# Altium schematic sheet PMP20634_Sheet1.SchDoc
size 431 x 279 mm; Date: Not shown in title block; ApprovedBy: Not shown in title block; CheckedBy: Not shown in title block; Author: Not shown in title block; CompanyName: Not shown in title block; Engineer: Not shown in title block; Organization: Not shown in title block; Address1: Not shown in title block; Address2: Not shown in title block; Address3: Not shown in title block; Address4: Not shown in title block; DocumentNumber: 1; Revision: Use project parameter SCH_Rev; SheetNumber: 1; SheetTotal: 1; PageSetup: Record=PageOptions|CenterHorizontal=True|CenterVertical=True|PrintScale=1.00|XCorrection=1.00|YCorrection=1.00|PrintKind=0|BorderSize=5000000|LeftOffset=0|BottomOffset=0|Orientation=2|PaperLength=1000|PaperWidth=1000|Scale=100|PaperSource=15|PrintQuality=600|MediaType=1|DitherType=10|PaperKind=Letter|PrintScaleMode=1; CurrentTime: Not shown in title block; CurrentDate: Not shown in title block; Time: Not shown in title block; DocumentFullPathAndName: Not shown in title block; DocumentName: Not shown in title block; ModifiedDate: Not shown in title block; ImagePath: Not shown in title block
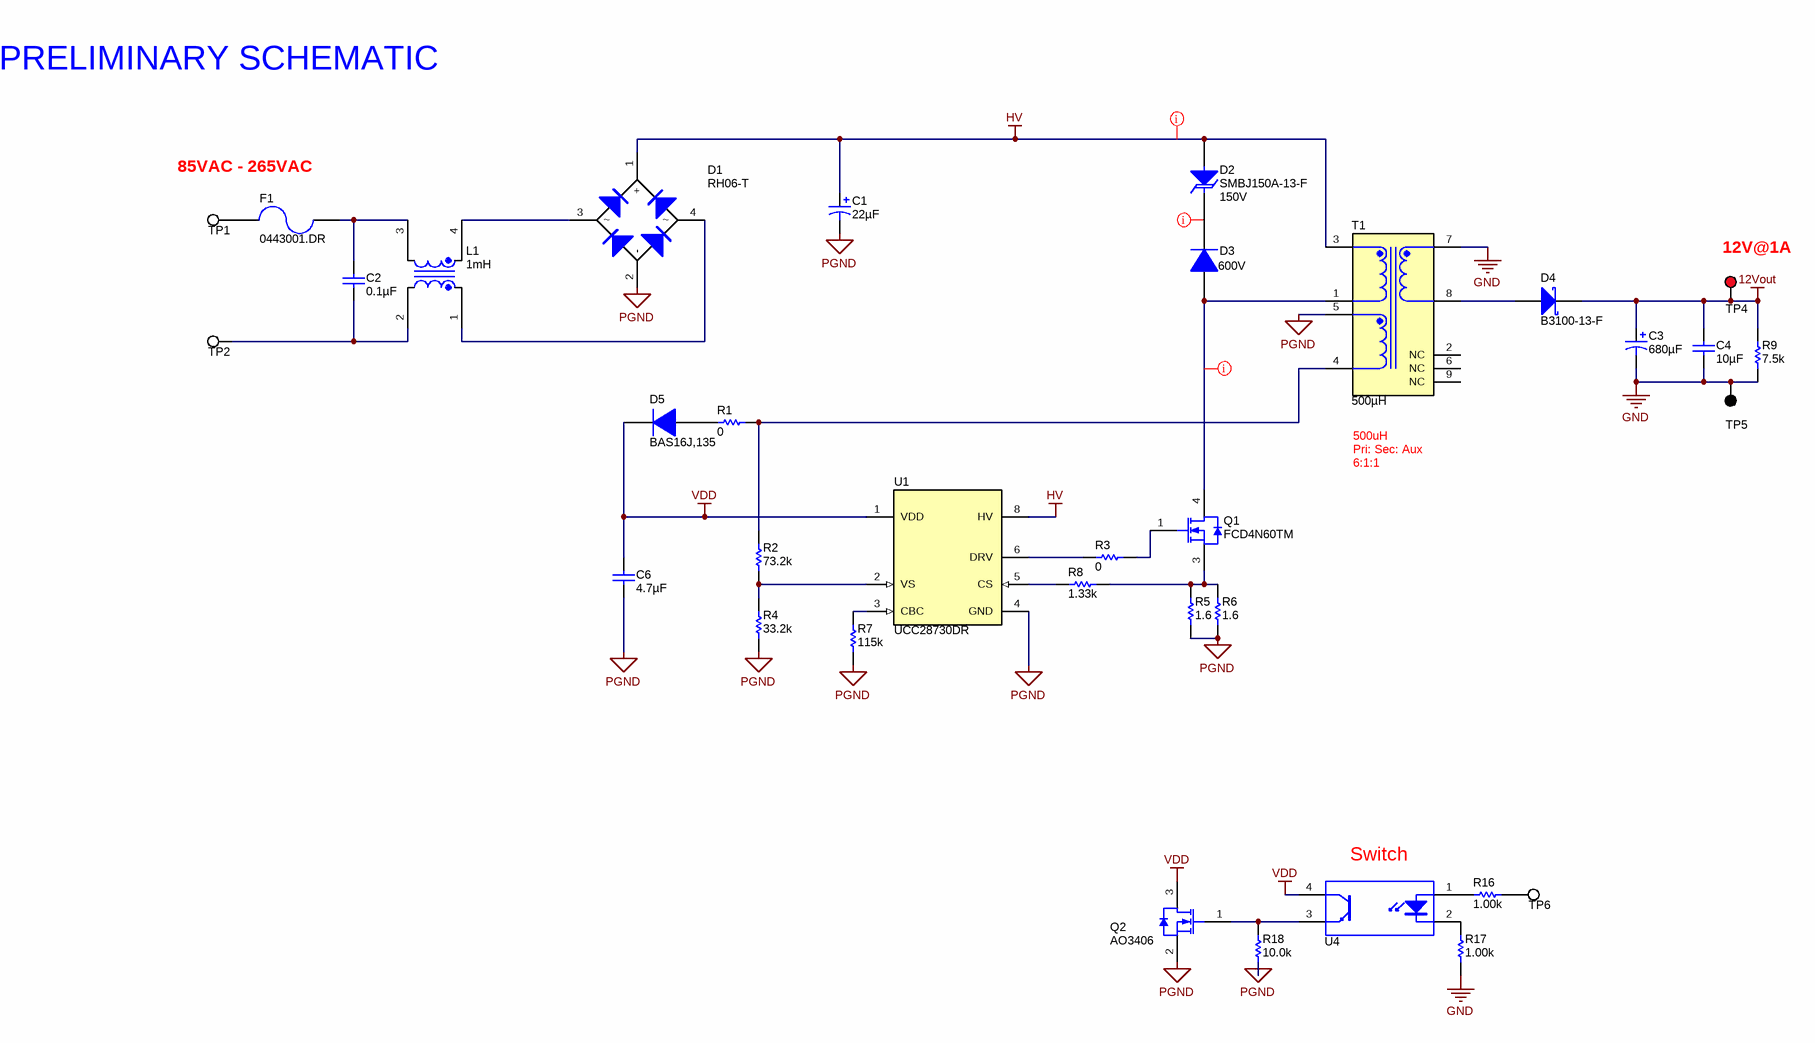
[diagram p0: PMP20634_Sheet1.SchDoc]

## Parts
C1  ValueDisplayed: 22µF  [KXG_1250x2000]  (hidden comment: EKXG401ELL220MK20S)
C2  ValueDisplayed: 0.1µF  [ECQUG_1500x800x1500]  (hidden comment: ECQ-U3A104MG)
C3  ValueDisplayed: 680µF  [Chemi-Con_1000x2000]  (hidden comment: EKZE250ELL681MJ20S)
C4  ValueDisplayed: 10µF  [0805_HV]  (hidden comment: GRM219R61E106KA12)
C6  ValueDisplayed: 4.7µF  [0603]  (hidden comment: GRM188R6YA475KE15D)
D1  RH06-T  [MiniDIP]
D2  SMBJ150A-13-F  value 150V  [SMB]
D3  Value2: 600V  [SMA]  (hidden comment: MURA160T3G)
D4  B3100-13-F  [SMC]
D5  BAS16J,135  [SOD-323F]
F1  0443001.DR  [FUSE_0443]
L1  ValueDisplayed: 1mH  [WE-CMB_XS]  (hidden comment: 744821201)
Q1  FCD4N60TM  [DPAK]
Q2  AO3406  [SOT-23]
R1  ValueDisplayed: 0  [0402]  (hidden comment: CRCW04020000Z0ED)
R2  ValueDisplayed: 73.2k  [0402]  (hidden comment: CRCW040273K2FKED)
R3  ValueDisplayed: 0  [0402]  (hidden comment: CRCW04020000Z0ED)
R4  ValueDisplayed: 33.2k  [0402]  (hidden comment: CRCW040233K2FKED)
R5  ValueDisplayed: 1.6  [0805_HV]  (hidden comment: CRCW08051R60JNEA)
R6  ValueDisplayed: 1.6  [0805_HV]  (hidden comment: CRCW08051R60JNEA)
R7  ValueDisplayed: 115k  [0402]  (hidden comment: CRCW0402115KFKED)
R8  ValueDisplayed: 1.33k  [0402]  (hidden comment: CRCW04021K33FKED)
R9  ValueDisplayed: 7.5k  [0402]  (hidden comment: CRCW04027K50JNED)
R16  ValueDisplayed: 1.00k  [0402]  (hidden comment: CRCW04021K00FKED)
R17  ValueDisplayed: 1.00k  [0402]  (hidden comment: CRCW04021K00FKED)
R18  ValueDisplayed: 10.0k  [0402]  (hidden comment: CRCW040210K0FKED)
T1  ValueDisplayed: 500µH  [Wurth_EE16-8-5_5280]  (hidden comment: 750316686)
TP1  5012  [Keystone5012]  (value not drawn)
TP2  5012  [Keystone5012]  (value not drawn)
TP4  5010  [Keystone5010]  (value not drawn)
TP5  5011  [Keystone5011]  (value not drawn)
TP6  5002  [Keystone5002]  (value not drawn)
U1  UCC28730DR  [D0007A_N]
U4  VOS617A-7X001T  [SSOP-4_VISHAY]  (value not drawn)

## Nets
12Vout: C3.1(+) C4.1 D4.1(K) R9.2 TP4.1
GND: C3.2(-) C4.2 R9.1 R17.2 T1.7 TP5.1
HV: C1.1(+) D1.1(+) D2.2(A) T1.3 U1.8(HV)
PGND: C1.2(-) C6.2 D1.2(-) Q2.2(S) R4.1 R5.1 R6.1 R7.1 R18.1 T1.5 U1.4(GND)
VDD: C6.1 D5.1(K) Q2.3(D) U1.1(VDD) U4.4(C)
NetC2_1: C2.1 F1.1 L1.3
NetC2_2: C2.2 L1.2 TP2.1
NetD1_3: D1.3 L1.4
NetD1_4: D1.4 L1.1
NetD2_1: D2.1(K) D3.1(K)
NetD3_2: D3.2(A) Q1.4(D) T1.1
NetD4_2: D4.2(A) T1.8
NetD5_2: D5.2(A) R1.1
NetF1_2: F1.2 TP1.1
NetQ1_1: Q1.1(G) R3.2
NetQ1_3: Q1.3(S) R5.2 R6.2 R8.2
NetQ2_1: Q2.1(G) R18.2 U4.3(E)
NetR1_2: R1.2 R2.2 T1.4
NetR2_1: R2.1 R4.2 U1.2(VS)
NetR3_1: R3.1 U1.6(DRV)
NetR7_2: R7.2 U1.3(CBC)
NetR8_1: R8.1 U1.5(CS)
NetR16_1: R16.1 TP6.1
NetR16_2: R16.2 U4.1(A)
NetR17_1: R17.1 U4.2(K)

Not connected (* = marked no-connect by the designer): T1 2(NC) 6(NC) 9(NC)

## Layout directives
rule Undefined: HV, NetD2_1, NetD3_2

## Notes on the sheet
- PRELIMINARY SCHEMATIC
- 85VAC - 265VAC
- (near TP4) 12V@1A
- (near T1) 500uH
- Pri: Sec: Aux
- 6:1:1
- (near U4) Switch
- Drawn By:
- SVN Rev:
- Number:
- TID #:
- Orderable:
- Rev:
- Sheet Title:
- File:
- Project Title:
- Designed for:
- Assembly Variant:
- Mod. Date:
- Sheet:
- Size:
- of
- B
- http://www.ti.com
- Texas Instruments and/or its licensors do not warrant the accuracy or completeness of this specification or any information contained therein. Texas Instruments and/or its licensors do not warrant that this design will meet the specifications, will be suitable for your application or fit for any particular purpose, or will operate in an implementation. Texas Instruments and/or its licensors do not warrant that the design is production worthy. You should completely validate and test your design implementation to confirm the system functionality for your application.
- Engineer:
- Contact:
- © Texas Instruments

## Library data of the parts
C1 = EKXG401ELL220MK20S: CAP, AL, 22 µF, 400 V, +/- 20%, TH; Manufacturer: Chemi-Con; Polarized: Y; CompType: Capacitor; Value: 22uF; U/M: EA; Cap_F: 0.000022; Tolerance_%: 20; Value1: Unknown; VDC_V: 400; Value2: 400V; IRMS_A: 0.26; TaMin_C: -40; TaMax_C: 105; Cap_Case: 12.5x20; SizeAreaWB_mm2: 210.25; SizeArea_mm2: 156.25; SizeX_mm: 12.5; SizeZ_mm: 21.5; AEC Category: Q200; SymbolVersion: 2008-07-09; PartNumber: EKXG401ELL220MK20S; PackageReference: 12.5x20mm; RoHS: Y; MountType: TH; Technology: AL; Series: KXG; SizeY_mm: 12.5; Publisher: Texas Instruments; LatestRevisionDate: 2016-10-27; ComponentLink1Description: Datasheet link; ComponentLink1URL: http://www.chemi-con.com/components/com_lcatalog/uploaded/3/3/2/185519594952d6c4a999b09.pdf; Supplier 1: Digi-Key; Supplier Part Number 1: 565-1463-ND; Supplier 2: Mouser; Supplier Part Number 2: 661-EKXG401ELL220MK2; Supplier 3: Farnell; Supplier Part Number 3: 2113044; AEC Qualified: ?
C2 = ECQ-U3A104MG: CAP, Film, 0.1 µF, 300 V, +/- 20%, TH; Manufacturer: Panasonic; Polarized: N; CompType: Capacitor; Value: 0.1uF; U/M: EA; Cap_F: 0.0000001; Tolerance_%: 20; Value1: Unknown; VDC_V: 300; Value2: 300V; TaMin_C: -40; TaMax_C: 100; Cap_Case: 15x8x15mm; AEC Category: Q200; SymbolVersion: 2008-07-09; PartNumber: ECQ-U3A104MG; PackageReference: TH, 2-Leads, Body 15x8mm, Pin Spacing 12.5mm; RoHS: Y; MountType: TH; Technology: Film; Series: ECQUG; Publisher: Texas Instruments; LatestRevisionDate: 2016-10-27; ComponentLink1Description: Datasheet link; ComponentLink1URL: http://industrial.panasonic.com/www-data/pdf/ABD0000/ABD0000CE30.pdf; Supplier 1: Digi-Key; Supplier Part Number 1: P11116-ND; Supplier 2: Mouser; Supplier Part Number 2: 667-ECQ-U3A104MG; Supplier 3: Farnell; Supplier Part Number 3: 1854815; AEC Qualified: ?
C3 = EKZE250ELL681MJ20S: CAP, AL, 680 µF, 25 V, +/- 20%, TH; Manufacturer: Chemi-Con; Polarized: Y; CompType: Capacitor; Value: 680uF; U/M: EA; Cap_F: 0.00068; Tolerance_%: 20; Value1: Unknown; VDC_V: 25; Value2: 25V; IRMS_A: 1.82; TaMin_C: -40; TaMax_C: 105; Cap_Case: 10x20; SizeAreaWB_mm2: 144; SizeArea_mm2: 100; SizeX_mm: 10; SizeZ_mm: 21.5; AEC Category: Q200; AEC Qualified: N; SymbolVersion: 2008-07-09; PartNumber: EKZE250ELL681MJ20S; PackageReference: D10xL20mm; RoHS: Y; MountType: TH; Technology: AL; Series: KZE; SizeY_mm: 10; Publisher: Texas Instruments; LatestRevisionDate: 2016-10-27; ComponentLink1Description: Datasheet link; ComponentLink1URL: http://www.chemi-con.co.jp/cgi-bin/CAT_DB/SEARCH/cat_db_al.cgi?e=e&j=p&pdfname=kze; Supplier 1: Digi-Key; Supplier Part Number 1: 565-1679-ND; Supplier 2: Mouser; Supplier Part Number 2: 661-EKZE250ELL681MJ2; Supplier 3: Farnell; Supplier Part Number 3: 1691149; AEC Grade: N/A
C4 = GRM219R61E106KA12: CAP, CERM, 10 µF, 25 V, +/- 10%, X5R, 0805; Manufacturer: MuRata; Polarized: N; CompType: Capacitor; Value: 10uF; U/M: EA; Cap_F: 0.00001; Tolerance_%: 10; Value1: Unknown; VDC_V: 25; Value2: 25V; TaMin_C: -55; TaMax_C: 85; Cap_Case: 0805; SizeArea_mm2: 2.5; SizeAreaWB_mm2: 6.75; SizeX_mm: 2; SizeY_mm: 1.25; SizeZ_mm: 1.45; AEC Category: Q200; SymbolVersion: 2008-07-09; PartNumber: GRM219R61E106KA12; PackageReference: 0805; RoHS: Y; MountType: SMT; Technology: Ceramic; TempCo: X5R; Published: 2008-06-19; Publisher: Texas Instruments; LatestRevisionDate: 2016-10-27; ComponentLink1Description: Datasheet link; ComponentLink1URL: http://www.murata.com/~/media/webrenewal/support/library/catalog/products/capacitor/mlcc/c02e.ashx; Supplier 1: Digi-Key; Supplier Part Number 1: 490-7207-1-ND; AEC Qualified: N; AEC Grade: N/A
C6 = GRM188R6YA475KE15D: CAP, CERM, 4.7 µF, 35 V, +/- 10%, X5R, 0603; Manufacturer: MuRata; Polarized: N; CompType: Capacitor; Value: 4.7uF; U/M: EA; Cap_F: 0.0000047; Tolerance_%: 10; Value1: Unknown; VDC_V: 35; Value2: 35V; TaMin_C: -55; TaMax_C: 85; SizeArea_mm2: 1.28; SizeAreaWB_mm2: 4.68; SizeX_mm: 1.6; SizeY_mm: 0.8; SizeZ_mm: 1; AEC Category: Q200; SymbolVersion: 2008-07-09; PartNumber: GRM188R6YA475KE15D; PackageReference: 0603; RoHS: Y; MountType: SMT; Technology: Ceramic; TempCo: X5R; Cap_Case: 0603; Published: 2008-06-19; Publisher: Texas Instruments; LatestRevisionDate: 2016-10-27; ComponentLink1Description: Datasheet link; ComponentLink1URL: http://psearch.murata.com/capacitor/product/GRM188R6YA475KE15%23.pdf; Supplier 1: Digi-Key; Supplier Part Number 1: 490-7205-1-ND; Supplier 2: Mouser; Supplier Part Number 2: 81-GRM188R6YA475KE5D; Supplier 3: Farnell; Supplier Part Number 3: 2426960; AEC Qualified: ?
D1 = RH06-T: Diode, Switching-Bridge, 600 V, 0.5 A, MiniDIP; Manufacturer: Diodes Inc.; U/M: EA; Vf_V: 1.15; Value: 600V; Value1: 0.5A; Value2: 1.15V; Io_A: 0.5; Vr_V: 600; TJmax_C: 150; SizeAreaWB_mm2: 62.1; SizeArea_mm2: 34.3; SizeX_mm: 7; SizeY_mm: 4.9; SizeZ_mm: 3; AEC Category: Q101; AEC Qualified: N; SymbolVersion: 2008-07-09; PartNumber: RH06-T; PackageReference: MiniDIP; CompType: Diode; MountType: SMT; Type: Switching-Bridge; RoHS: Y; Published: 2008-06-26; Publisher: Texas Instruments; LatestRevisionDate: 2016-10-18; ComponentLink1Description: Datasheet link; ComponentLink1URL: http://www.diodes.com/datasheets/ds30137.pdf; Supplier 1: Digi-Key; Supplier Part Number 1: RH06DICT-ND; Supplier 2: Mouser; Supplier Part Number 2: 621-RH06-T
D2 = SMBJ150A-13-F: Diode, TVS, Uni, 150 V, 243 Vc, SMB; Manufacturer: Diodes Inc.; U/M: EA; Power_W: 5; Vr_V: 150; Value1: 5W; SizeAreaWB_mm2: 44.156; SizeArea_mm2: 21.336; SizeX_mm: 5.6; SizeY_mm: 3.81; SizeZ_mm: 2.6; AEC Category: Q101; CompType: TVS; SymbolVersion: 2012-01-13; PartNumber: SMBJ150A-13-F; PackageReference: SMB; Vz_V: N/A; MountType: SMT; RoHS: Y; ComponentLink1Description: Datasheet link; ComponentLink1URL: http://www.diodes.com/datasheets/ds19002.pdf; Published: 2008-10-08; Publisher: Texas Instruments; LatestRevisionDate: 2017-01-23; LatestRevisionNote: Updated Supplier Data; Supplier 1: Digi-Key; Supplier Part Number 1: SMBJ150A-FDICT-ND; Supplier 2: Mouser; Supplier Part Number 2: 621-SMBJ150A-13-F; AEC Qualified: ?
D3 = MURA160T3G: Diode, Ultrafast, 600V, 1A, SMA; Manufacturer: ON Semiconductor; Value: 1.05V; U/M: EA; Vf_V: 1.05; Io_A: 1; Vr_V: 600; TJmax_C: 175; CompType: Diode; PartNumber: MURA160T3G; SymbolVersion: 2008-12-08; MountType: SMT; RoHS: Y; PackageReference: SMA; Value1: 1A; Type: Ultrafast; Published: 2008-06-26; Publisher: Texas Instruments; LatestRevisionDate: 2013-02-13; ComponentLink1Description: Datasheet link; ComponentLink1URL: http://www.onsemi.com/pub_link/Collateral/MURA160T3-D.PDF; Supplier 1: Digi-Key; Supplier Part Number 1: MURA160T3GOSCT-ND; Supplier 2: Mouser; Supplier Part Number 2: 863-MURA160T3G; Supplier 3: Farnell; Supplier Part Number 3: 1459149
D4 = B3100-13-F: Diode, Schottky, 100 V, 3 A, SMC; Manufacturer: Diodes Inc.; U/M: EA; Vf_V: 0.79; Value: 100V; Value1: 3A; Value2: 0.79V; Io_A: 3; Vr_V: 100; TJmax_C: 125; RJC_CperW: 10; SizeAreaWB_mm2: 83.2686; SizeArea_mm2: 50.5686; SizeX_mm: 8.13; SizeY_mm: 6.22; SizeZ_mm: 2.6; AEC Category: Q101; CompType: Diode; SymbolVersion: 2008-12-08; PartNumber: B3100-13-F; PackageReference: SMC; MountType: SMT; Type: Schottky; RoHS: Y; Published: 2008-06-26; Publisher: Texas Instruments; LatestRevisionDate: 2016-10-18; ComponentLink1Description: Datasheet link; ComponentLink1URL: http://www.diodes.com/datasheets/ds30020.pdf; Supplier 1: Digi-Key; Supplier Part Number 1: B3100-FDICT-ND; Supplier 2: Mouser; Supplier Part Number 2: 621-B3100-F; Supplier 3: Farnell; Supplier Part Number 3: 1858626; AEC Qualified: ?
D5 = BAS16J,135: Diode, Switching, 100 V, 0.25 A, SOD-323F; Manufacturer: NXP Semiconductor; U/M: EA; Value: 100V; Value1: 0.25A; Io_A: 0.25; Vr_V: 100; TJmax_C: 150; SizeAreaWB_mm2: 7.875; SizeArea_mm2: 3.125; SizeX_mm: 2.5; SizeY_mm: 1.25; SizeZ_mm: 0.8; AEC Category: Q101; SymbolVersion: 2008-12-08; PartNumber: BAS16J,135; PackageReference: SOD-323F; CompType: Diode; Value2: V; MountType: SMT; Type: Switching; RoHS: Y; Published: 2008-06-26; Publisher: Texas Instruments; LatestRevisionDate: 2016-10-18; ComponentLink1Description: Datasheet link; ComponentLink1URL: http://www.nxp.com/documents/data_sheet/BAS16_SER.pdf; Supplier 1: Digi-Key; Supplier Part Number 1: 568-5996-1-ND; Supplier 2: Mouser; Supplier Part Number 2: 771-BAS16J135; Supplier 3: Newark; Supplier Part Number 3: 81R1828; AEC Qualified: ?
F1 = 0443001.DR: Fuse, 1 A, 250VAC/VDC, SMD; Manufacturer: Littelfuse; VDC_V: 250; Interrupt_AC: 50; Irating_A: 1; Rtyp_Ohm: 0.18; MeltingTyp: 10.17; SymbolVersion: 2008-07-09; PartNumber: 0443001.DR; PackageReference: FUSE 10.1x3.12x3.13mm; MountType: SMT; CompType: Fuse; RoHS: Y; Interrupt_DC: 250; VAC_V: 250; Published: 2009-03-05; Publisher: Texas Instruments; LatestRevisionDate: 2016-09-30; ComponentLink1Description: Datasheet URL; ComponentLink1URL: http://www.littelfuse.com/~/media/electronics/datasheets/fuses/littelfuse_fuse_443_datasheet.pdf.pdf; Supplier 1: Digi-Key; Supplier Part Number 1: F2906CT-ND; Supplier 2: Mouser; Supplier Part Number 2: 576-0443001.DR; Supplier 3: Farnell; Supplier Part Number 3: 1664602
L1 = 744821201: Coupled inductor, 1 mH, 2 A, 0.045 ohm, TH; Manufacturer: Wurth Elektronik; SymbolCreator: a0412235; Value: 1mH; Ind_H: 1.0E-3; DCR_ohm: 0.045; SymbolVersion: 2013-02-26; PartNumber: 744821201; PackageReference: 15 x 18 x 7.5mm; MountType: TH; ComponentLink1URL: http://katalog.we-online.de/pbs/datasheet/744821201.pdf; ComponentLink1Description: Datasheet URL; RoHS: Y; CompType: Coupled Inductor; Publisher: Texas Instruments; Published: 2008-05-16; LatestRevisionDate: 2016-10-21; Supplier 1: Digi-Key; Supplier Part Number 1: 732-1435-ND; Supplier 2: Mouser; Supplier Part Number 2: 710-744821201; Supplier 3: Farnell; Supplier Part Number 3: 1636278
Q1 = FCD4N60TM: MOSFET, N-CH, 600 V, 3.9 A, DPAK; Manufacturer: Fairchild Semiconductor; Alternate Manufacturer: None; U/M: EA; ChType: N; Value: 600V; VdsMax_V: 600; Value1: ? ohm; Value2: 12.8 nC; QgTyp_nC: 12.8; Vgs_V: 30; IdsMax_A: 3.9; SizeAreaWB_mm2: 101.7114; SizeArea_mm2: 64.8114; SizeX_mm: 9.91; SizeY_mm: 6.54; SizeZ_mm: 2.29; AEC Category: Q101; SymbolVersion: 2008-07-28; CompType: MOSFET; PartNumber: FCD4N60TM; PackageReference: DPAK; RoHS: Y; MountType: SMT; Published: 2008-06-19; Publisher: Texas Instruments; LatestRevisionDate: 2016-10-26; LatestRevisionNote: Added parts.; ComponentLink1Description: Datasheet link; ComponentLink1URL: http://www.fairchildsemi.com/ds/FC/FCD4N60.pdf; Supplier 1: Digi-Key; Supplier Part Number 1: FCD4N60TMCT-ND; Supplier 2: Mouser; Supplier Part Number 2: 512-FCD4N60TM; Supplier 3: Farnell; Supplier Part Number 3: 1324776; AEC Qualified: ?
Q2 = AO3406: MOSFET, N-CH, 30 V, 3.6 A, SOT-23; Manufacturer: AOS; Alternate Manufacturer: None; U/M: EA; ChType: N; Value: 30V; VdsMax_V: 30; Value1: 0.07 ohm; Rdson45_ohm: 0.07; Value2: 4.05 nC; QgTyp_nC: 4.05; Vgs_V: 20; IdsMax_A: 3.6; SizeAreaWB_mm2: 14; SizeArea_mm2: 7.5; SizeX_mm: 2.5; SizeY_mm: 3; SizeZ_mm: 1.1; AEC Category: Q101; SymbolVersion: 2008-07-28; CompType: MOSFET; PartNumber: AO3406; PackageReference: SOT-23; RoHS: Y; MountType: SMT; Published: 2008-06-19; Publisher: Texas Instruments; LatestRevisionDate: 2016-10-26; LatestRevisionNote: Added parts.; ComponentLink1Description: Datasheet link; ComponentLink1URL: http://www.aosmd.com/res/data_sheets/AO3406.pdf; Supplier 1: Digi-Key; Supplier Part Number 1: 785-1005-1-ND; AEC Qualified: ?
R1 R3 = CRCW04020000Z0ED: RES, 0, 5%, 0.063 W, 0402; Manufacturer: Vishay-Dale; CompType: Resistor; Value: 0; Value_Code: 0000; Tolerance_%: 5; Power_W: 0.063; Value2: 0.063W; VDC_V: 50; TempCo: 200 ppm/C; SizeArea_mm2: 0.5; SizeX_mm: 1; SizeZ_mm: 0.6; EIA_Code: E24; U/M: EA; AEC Category: Q200; SymbolVersion: 2009-05-29; PartNumber: CRCW04020000Z0ED; PackageReference: 0402; RoHS: Y; Res_ohm: 0; Value1: 5%; MountType: SMT; Technology: Thick Film; SizeY_mm: 0.5; Published: 2008-06-26; Publisher: Texas Instruments; LatestRevisionDate: 2016-10-12; ComponentLink1Description: Datasheet link; ComponentLink1URL: http://www.vishay.com/docs/20035/dcrcwe3.pdf; Supplier 1: Digi-Key; Supplier Part Number 1: 541-0.0JCT-ND; Supplier 2: Mouser; Supplier Part Number 2: 71-CRCW0402-0-E3; Supplier 3: Farnell; Supplier Part Number 3: 1469661; AEC Qualified: ?
R2 = CRCW040273K2FKED: RES, 73.2 k, 1%, 0.063 W, 0402; Manufacturer: Vishay-Dale; CompType: Resistor; Value: 73.2k; Res_ohm: 73200; Value_Code: 73k2; Tolerance_%: 1; Power_W: 0.063; Value2: 0.063W; VDC_V: 50; TempCo: 100 ppm/C; SizeArea_mm2: 0.5; SizeZ_mm: 0.6; EIA_Code: E96; U/M: EA; AEC Category: Q200; SymbolVersion: 2009-05-29; PartNumber: CRCW040273K2FKED; PackageReference: 0402; RoHS: Y; Value1: 1%; MountType: SMT; Technology: Thick Film; SizeX_mm: 1; SizeY_mm: 0.5; Published: 2008-06-26; Publisher: Texas Instruments; LatestRevisionDate: 2016-10-12; ComponentLink1Description: Datasheet link; ComponentLink1URL: http://www.vishay.com/docs/20035/dcrcwe3.pdf; Supplier 1: Digi-Key; Supplier Part Number 1: 541-73.2KLCT-ND; Supplier 2: Mouser; Supplier Part Number 2: 71-CRCW0402-73.2K-E3; Supplier 3: Farnell; Supplier Part Number 3: 1151476; AEC Qualified: ?
R4 = CRCW040233K2FKED: RES, 33.2 k, 1%, 0.063 W, 0402; Manufacturer: Vishay-Dale; CompType: Resistor; Value: 33.2k; Res_ohm: 33200; Value_Code: 33k2; Tolerance_%: 1; Power_W: 0.063; Value2: 0.063W; VDC_V: 50; TempCo: 100 ppm/C; SizeArea_mm2: 0.5; SizeZ_mm: 0.6; EIA_Code: E96; U/M: EA; AEC Category: Q200; SymbolVersion: 2009-05-29; PartNumber: CRCW040233K2FKED; PackageReference: 0402; RoHS: Y; Value1: 1%; MountType: SMT; Technology: Thick Film; SizeX_mm: 1; SizeY_mm: 0.5; Published: 2008-06-26; Publisher: Texas Instruments; LatestRevisionDate: 2016-10-12; ComponentLink1Description: Datasheet link; ComponentLink1URL: http://www.vishay.com/docs/20035/dcrcwe3.pdf; Supplier 1: Digi-Key; Supplier Part Number 1: 541-33.2KLCT-ND; Supplier 2: Mouser; Supplier Part Number 2: 71-CRCW0402-33.2K-E3; Supplier 3: Farnell; Supplier Part Number 3: 1469706; AEC Qualified: ?
R5 R6 = CRCW08051R60JNEA: RES, 1.6, 5%, 0.125 W, 0805; Manufacturer: Vishay-Dale; CompType: Resistor; Value: 1.6; Value_Code: 1R60; Tolerance_%: 5; Power_W: 0.125; Value2: 0.125W; VDC_V: 150; TempCo: 200 ppm/C; SizeArea_mm2: 2.5; SizeX_mm: 2; SizeY_mm: 1.25; SizeZ_mm: 1.45; EIA_Code: E24; U/M: EA; AEC Category: Q200; SymbolVersion: 2009-05-29; PartNumber: CRCW08051R60JNEA; PackageReference: 0805; RoHS: Y; Res_ohm: 1.6; Value1: 5%; MountType: SMT; Technology: Thick Film; Published: 2008-06-26; Publisher: Texas Instruments; LatestRevisionDate: 2016-09-30; ComponentLink1Description: Datasheet link; ComponentLink1URL: http://www.vishay.com/docs/20035/dcrcwe3.pdf; Supplier 1: Digi-Key; Supplier Part Number 1: 541-1.6ACT-ND; Supplier 2: Mouser; Supplier Part Number 2: 71-CRCW08051R60JNEA; AEC Qualified: ?
R7 = CRCW0402115KFKED: RES, 115 k, 1%, 0.063 W, 0402; Manufacturer: Vishay-Dale; CompType: Resistor; Value: 115k; Res_ohm: 115000; Tolerance_%: 1; Power_W: 0.063; Value2: 0.063W; VDC_V: 50; TempCo: 100 ppm/C; SizeArea_mm2: 0.5; SizeZ_mm: 0.6; EIA_Code: E96; U/M: EA; AEC Category: Q200; SymbolVersion: 2009-05-29; PartNumber: CRCW0402115KFKED; PackageReference: 0402; RoHS: Y; Value_Code: 115k; Value1: 1%; MountType: SMT; Technology: Thick Film; SizeX_mm: 1; SizeY_mm: 0.5; Published: 2008-06-26; Publisher: Texas Instruments; LatestRevisionDate: 2016-10-12; ComponentLink1Description: Datasheet link; ComponentLink1URL: http://www.vishay.com/docs/20035/dcrcwe3.pdf; Supplier 1: Digi-Key; Supplier Part Number 1: 541-115KLCT-ND; Supplier 2: Mouser; Supplier Part Number 2: 71-CRCW0402-115K-E3; Supplier 3: Farnell; Supplier Part Number 3: 1150797; AEC Qualified: ?
R8 = CRCW04021K33FKED: RES, 1.33 k, 1%, 0.063 W, 0402; Manufacturer: Vishay-Dale; CompType: Resistor; Value: 1.33k; Res_ohm: 1330; Value_Code: 1k33; Tolerance_%: 1; Power_W: 0.063; Value2: 0.063W; VDC_V: 50; TempCo: 100 ppm/C; SizeArea_mm2: 0.5; SizeZ_mm: 0.6; EIA_Code: E96; U/M: EA; AEC Category: Q200; SymbolVersion: 2009-05-29; PartNumber: CRCW04021K33FKED; PackageReference: 0402; RoHS: Y; Value1: 1%; MountType: SMT; Technology: Thick Film; SizeX_mm: 1; SizeY_mm: 0.5; Published: 2008-06-26; Publisher: Texas Instruments; LatestRevisionDate: 2016-10-12; ComponentLink1Description: Datasheet link; ComponentLink1URL: http://www.vishay.com/docs/20035/dcrcwe3.pdf; Supplier 1: Digi-Key; Supplier Part Number 1: 541-1.33KLCT-ND; Supplier 2: Mouser; Supplier Part Number 2: 71-CRCW0402-1.33K-E3; Supplier 3: Farnell; Supplier Part Number 3: 1158265; AEC Qualified: ?
R9 = CRCW04027K50JNED: RES, 7.5 k, 5%, 0.063 W, 0402; Manufacturer: Vishay-Dale; CompType: Resistor; Value: 7.5k; Res_ohm: 7500; Value_Code: 7k50; Tolerance_%: 5; Power_W: 0.063; Value2: 0.063W; VDC_V: 50; TempCo: 200 ppm/C; SizeArea_mm2: 0.5; SizeX_mm: 1; SizeZ_mm: 0.6; EIA_Code: E24; U/M: EA; AEC Category: Q200; SymbolVersion: 2009-05-29; PartNumber: CRCW04027K50JNED; PackageReference: 0402; RoHS: Y; Value1: 5%; MountType: SMT; Technology: Thick Film; SizeY_mm: 0.5; Published: 2008-06-26; Publisher: Texas Instruments; LatestRevisionDate: 2016-10-12; ComponentLink1Description: Datasheet link; ComponentLink1URL: http://www.vishay.com/docs/20035/dcrcwe3.pdf; Supplier 1: Digi-Key; Supplier Part Number 1: 541-7.5KJCT-ND; Supplier 2: Mouser; Supplier Part Number 2: 71-CRCW0402J-7.5K-E3; Supplier 3: Farnell; Supplier Part Number 3: 1570691; AEC Qualified: ?
R16 R17 = CRCW04021K00FKED: RES, 1.00 k, 1%, 0.063 W, 0402; Manufacturer: Vishay-Dale; CompType: Resistor; Value: 1.00k; Res_ohm: 1000; Value_Code: 1k00; Tolerance_%: 1; Power_W: 0.063; Value2: 0.063W; VDC_V: 50; TempCo: 100 ppm/C; SizeArea_mm2: 0.5; SizeZ_mm: 0.6; EIA_Code: E96; U/M: EA; AEC Category: Q200; SymbolVersion: 2009-05-29; PartNumber: CRCW04021K00FKED; PackageReference: 0402; RoHS: Y; Value1: 1%; MountType: SMT; Technology: Thick Film; SizeX_mm: 1; SizeY_mm: 0.5; Published: 2008-06-26; Publisher: Texas Instruments; LatestRevisionDate: 2016-10-12; ComponentLink1Description: Datasheet link; ComponentLink1URL: http://www.vishay.com/docs/20035/dcrcwe3.pdf; Supplier 1: Digi-Key; Supplier Part Number 1: 541-1.00KLCT-ND; Supplier 2: Mouser; Supplier Part Number 2: 71-CRCW0402-1.0K-E3; Supplier 3: Farnell; Supplier Part Number 3: 1469662; AEC Qualified: ?
R18 = CRCW040210K0FKED: RES, 10.0 k, 1%, 0.063 W, 0402; Manufacturer: Vishay-Dale; CompType: Resistor; Value: 10.0k; Res_ohm: 10000; Value_Code: 10k0; Tolerance_%: 1; Power_W: 0.063; Value2: 0.063W; VDC_V: 50; TempCo: 100 ppm/C; SizeArea_mm2: 0.5; SizeZ_mm: 0.6; EIA_Code: E96; U/M: EA; AEC Category: Q200; SymbolVersion: 2009-05-29; PartNumber: CRCW040210K0FKED; PackageReference: 0402; RoHS: Y; Value1: 1%; MountType: SMT; Technology: Thick Film; SizeX_mm: 1; SizeY_mm: 0.5; Published: 2008-06-26; Publisher: Texas Instruments; LatestRevisionDate: 2016-10-12; ComponentLink1Description: Datasheet link; ComponentLink1URL: http://www.vishay.com/docs/20035/dcrcwe3.pdf; Supplier 1: Digi-Key; Supplier Part Number 1: 541-10.0KLCT-ND; Supplier 2: Mouser; Supplier Part Number 2: 71-CRCW0402-10K-E3; Supplier 3: Farnell; Supplier Part Number 3: 1469669; AEC Qualified: ?
T1 = 750316686: Transformer, 500 uH, EE16/8/5, TH; Manufacturer: Wurth Elektronik; SymbolCreator: a0411947; Value: 500uH; Lp: 500; DCR_ohm: 0.64; LeakageL: 20; Ns1toNp: 1.67; Rs1: 0.035; SizeAreaWB_mm2: 572; SizeArea_mm2: 480; SizeX_mm: 24; SizeZ_mm: 16; SymbolVersion: 2017-01-26; PartNumber: 750316686; MountType: TH; PackageReference: EE16/8/5; RoHS: Y; SizeY_mm: 20; ComponentLink1URL: https://sps06.itg.ti.com/sites/KMS/crossdivteams/altium/docs/ComponentDatasheets/750316686r00 spec.pdf; ComponentLink1Description: Datasheet URL; CompType: Transformer; Publisher: Texas Instruments; LatestRevisionDate: 2017-01-26
TP1 TP2 = 5012: Test Point, Multipurpose, White, TH; Manufacturer: Keystone; CompType: Test Point Loop; ContactFinish: Silver; SymbolVersion: 2008-04-04; PartNumber: 5012; PackageReference: White Multipurpose Testpoint; RoHS: Y; MountType: TH; ComponentLink1Description: Datasheet URL; ComponentLink1URL: http://www.keyelco.com/userAssets/file/M60-2p60.pdf; Color: White; Publisher: Texas Instruments; LatestRevisionDate: 2016-09-27; Supplier 1: Digi-Key; Supplier Part Number 1: 36-5012-ND; Supplier 2: Mouser; Supplier Part Number 2: 534-5012
TP4 = 5010: Test Point, Multipurpose, Red, TH; Manufacturer: Keystone; CompType: Test Point Loop; ContactFinish: Silver; SymbolVersion: 2008-04-04; PartNumber: 5010; PackageReference: Red Multipurpose Testpoint; RoHS: Y; MountType: TH; ComponentLink1Description: Datasheet URL; ComponentLink1URL: http://www.keyelco.com/userAssets/file/M60-2p60.pdf; Color: Red; Publisher: Texas Instruments; LatestRevisionDate: 2016-09-27; Supplier 1: Digi-Key; Supplier Part Number 1: 36-5010-ND; Supplier 2: Mouser; Supplier Part Number 2: 534-5010
TP5 = 5011: Test Point, Multipurpose, Black, TH; Manufacturer: Keystone; CompType: Test Point Loop; ContactFinish: Silver; SymbolVersion: 2008-04-04; PartNumber: 5011; PackageReference: Black Multipurpose Testpoint; RoHS: Y; MountType: TH; ComponentLink1Description: Datasheet URL; ComponentLink1URL: http://www.keyelco.com/userAssets/file/M60-2p60.pdf; Color: Black; Publisher: Texas Instruments; LatestRevisionDate: 2016-09-27; Supplier 1: Digi-Key; Supplier Part Number 1: 36-5011-ND; Supplier 2: Mouser; Supplier Part Number 2: 534-5011
TP6 = 5002: Test Point, Miniature, White, TH; Manufacturer: Keystone; CompType: Test Point Loop; ContactFinish: Silver; SymbolVersion: 2008-04-04; PartNumber: 5002; PackageReference: White Miniature Testpoint; RoHS: Y; MountType: TH; ComponentLink1Description: Datasheet URL; ComponentLink1URL: http://www.keyelco.com/userAssets/file/M60-2p60.pdf; Color: White; Publisher: Texas Instruments; LatestRevisionDate: 2016-09-27; Supplier 1: Digi-Key; Supplier Part Number 1: 36-5002-ND; Supplier 2: Mouser; Supplier Part Number 2: 534-5002; Supplier 3: Newark; Supplier Part Number 3: 82H9632
U1 = UCC28730DR: Constant-Voltage Constant-Current Flyback Controller With PSR and Wake-Up Monitoring, D0007A (SOIC-7); Manufacturer: Texas Instruments; SymbolCreator: x0208325; SizeArea_mm2: 29.4; SizeAreaWB_mm2: 55.2; SizeX_mm: 6; SizeY_mm: 4.9; SizeZ_mm: 1.75; CompType: IC; U/M: EA; SymbolVersion: 2016-2-18; PartNumber: UCC28730DR; Alternate PartNumber: UCC28730D; PackageReference: D0007A; PackageDescription: SOIC-7; MountType: SMT; ComponentLink1Description: Datasheet Link; ComponentLink1URL: http://www.ti.com/lit/ds/symlink/ucc28730.pdf; RoHS: Y; Publisher: Texas Instruments; LatestRevisionDate: 2016-10-26; Alternate Manufacturer: Texas Instruments
U4 = VOS617A-7X001T: Optocoupler, 3.75 kV, 80-160% CTR, SMT; Manufacturer: Vishay-Semiconductor; CTR (Min): 80%; CTR (Max): 160%; Voltage_Isolation_Vrms: 3750V; SymbolVersion: 2015-11-09; PartNumber: VOS617A-7X001T; CompType: Optocoupler; MountType: SMT; PackageReference: 7x2.12x2.6mm; RoHS: Y; ComponentLink1Description: Datasheet URL; ComponentLink1URL: http://www.vishay.com/docs/83497/vos617a.pdf; Publisher: Texas Instruments; LatestRevisionDate: 2016-10-13; Supplier 1: Digi-Key; Supplier Part Number 1: VOS617A-7X001T-ND; Supplier 2: Mouser; Supplier Part Number 2: 78-VOS617A-7X001T